# Altium schematic sheet Motor Connection.SchDoc: Motor Connection
size A4; DocumentNumber: 9; SheetNumber: 9; SheetTotal: 50
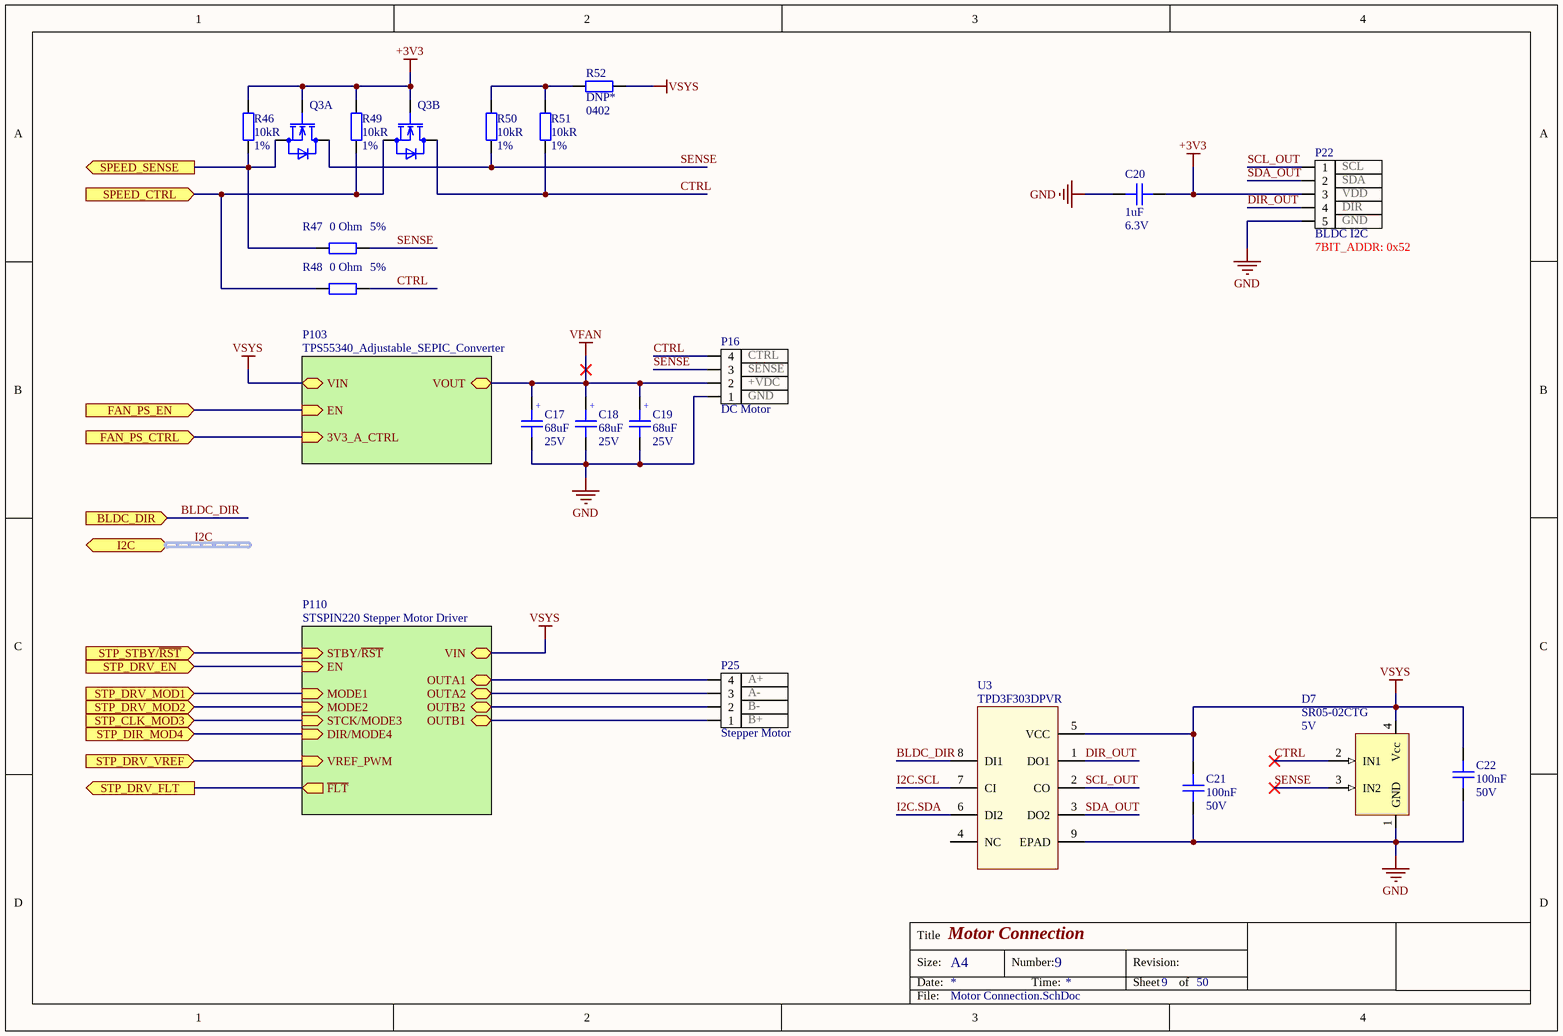
[diagram p0: Motor Connection.SchDoc]

## Parts
C17  Capacitance: 68uF  Rated Voltage: 25V  [WCAP-ASLI_6.3x5.5]  (hidden comment: CAP ALUM 68 UF 20% 25 V SMD)
C18  Capacitance: 68uF  Rated Voltage: 25V  [WCAP-ASLI_6.3x5.5]  (hidden comment: CAP ALUM 68 UF 20% 25 V SMD)
C19  Capacitance: 68uF  Rated Voltage: 25V  [WCAP-ASLI_6.3x5.5]  (hidden comment: CAP ALUM 68 UF 20% 25 V SMD)
C20  Capacitance: 1uF  Voltage Rating: 6.3V  [C0402]  (hidden comment: CAP CER 1UF 6.3V X5R 0402)
C21  Capacitance: 100nF  Voltage: 50V  [C0402]  (hidden comment: CAP CER 0.1UF 50V X7R 0402)
C22  Capacitance: 100nF  Voltage: 50V  [C0402]  (hidden comment: CAP CER 0.1UF 50V X7R 0402)
D7  SR05-02CTG  Reverse Standoff Voltage: 5V  [SOT-143]
P16  DC Motor  pin_1: GND  pin_2: +VDC  pin_3: SENSE  pin_4: CTRL  [CONN_S4B-ZR(LF)(SN)]
P22  BLDC I2C  pin_1: SCL  pin_2: SDA  pin_3: VDD  pin_4: DIR  pin_5: GND  7BIT_ADDR: 0x52  [CONN_S5B-ZR(LF)(SN)]
P25  Stepper Motor  pin_1: B+  pin_2: B-  pin_3: A-  pin_4: A+  [CONN_S4B-ZR(LF)(SN)]
Q3  DMN32D2LV-7  [SON_400UV-7_DIO]  (value not drawn)  (parts A,B of 2)
R46  Resistance: 10kR  Tolerance: 1%  [R0402]  (hidden comment: RES SMD 10K OHM 1% 1/16W 0402)
R47  Tolerance: 5%  Resistance: 0 Ohm  [R0402]  (hidden comment: RES SMD 0 OHM JUMPER 1/16W 0402)
R48  Tolerance: 5%  Resistance: 0 Ohm  [R0402]  (hidden comment: RES SMD 0 OHM JUMPER 1/16W 0402)
R49  Resistance: 10kR  Tolerance: 1%  [R0402]  (hidden comment: RES SMD 10K OHM 1% 1/16W 0402)
R50  Resistance: 10kR  Tolerance: 1%  [R0402]  (hidden comment: RES SMD 10K OHM 1% 1/16W 0402)
R51  Resistance: 10kR  Tolerance: 1%  [R0402]  (hidden comment: RES SMD 10K OHM 1% 1/16W 0402)
R52  DNP*  Case/Package: 0402  [R0402]  (no BOM)
U3  TPD3F303DPVR  [DPV8_1P7X0P4]

## Sub-sheets
P103 = TPS55340_Adjustable_SEPIC_Converter: EN (in), VIN, VOUT, 3V3_A_CTRL (in)
P110 = STSPIN220 Stepper Motor Driver: MODE1 (in), OUTB1, VREF_PWM (in), EN (in), MODE2 (in), OUTB2, OUTA2, DIR/MODE4 (in), STCK/MODE3 (in), ~{FLT} (out), STBY/~{RST} (in), OUTA1, VIN

## Ports
BLDC_DIR (in), FAN_PS_CTRL (in), FAN_PS_EN (in), I2C (harness I2C), SPEED_CTRL (in), SPEED_SENSE (out), STP_CLK_MOD3 (in), STP_DIR_MOD4 (in), STP_DRV_EN (in), STP_DRV_FLT (out), STP_DRV_MOD1 (in), STP_DRV_MOD2 (in), STP_DRV_VREF (in), STP_STBY/~{RST} (in)

## Nets
+3V3: C20.2 P22.3 Q3.2(G) Q3.5(G) R46.1 R49.1
GND: C17.2 C18.2 C19.2 C20.1 C21.2 C22.1 D7.1(GND) P16.1 P22.5 U3.9(EPAD)
VFAN: C17.1 C18.1 C19.1 P16.2 ; sheet P103/VOUT
VSYS: C21.1 C22.2 D7.4(Vcc) R52.1 U3.5(VCC) ; sheet P110/VIN, sheet P103/VIN
BLDC_DIR: U3.8(DI1) ; port BLDC_DIR
CTRL: D7.2(IN1) P16.4 Q3.3(D) R48.2 R51.2
DIR_OUT: P22.4 U3.1(DO1)
FAN_PS_CTRL: port FAN_PS_CTRL, sheet P103/3V3_A_CTRL
FAN_PS_EN: port FAN_PS_EN, sheet P103/EN
I2C.SCL: U3.7(CI)
I2C.SDA: U3.6(DI2)
SCL_OUT: P22.1 U3.2(CO)
SDA_OUT: P22.2 U3.3(DO2)
SENSE: D7.3(IN2) P16.3 Q3.6(D) R47.2 R50.2
SPEED_CTRL: Q3.4(S) R48.1 R49.2 ; port SPEED_CTRL
SPEED_SENSE: Q3.1(S) R46.2 R47.1 ; port SPEED_SENSE
STP_CLK_MOD3: port STP_CLK_MOD3, sheet P110/STCK/MODE3
STP_DIR_MOD4: port STP_DIR_MOD4, sheet P110/DIR/MODE4
STP_DRV_EN: port STP_DRV_EN, sheet P110/EN
STP_DRV_FLT: port STP_DRV_FLT, sheet P110/~{FLT}
STP_DRV_MOD1: port STP_DRV_MOD1, sheet P110/MODE1
STP_DRV_MOD2: port STP_DRV_MOD2, sheet P110/MODE2
STP_DRV_VREF: port STP_DRV_VREF, sheet P110/VREF_PWM
STP_STBY/~{RST}: port STP_STBY/~{RST}, sheet P110/STBY/~{RST}
NetP25_1: P25.1 ; sheet P110/OUTB1
NetP25_2: P25.2 ; sheet P110/OUTB2
NetP25_3: P25.3 ; sheet P110/OUTA2
NetP25_4: P25.4 ; sheet P110/OUTA1
NetR50_1: R50.1 R51.1 R52.2

Not connected (* = marked no-connect by the designer): U3 4(NC)

## Buses and harness runs
harness I2C = port I2C

## Notes on the sheet
- Title
- Size:
- Date:
- A4
- Number:
- Time:
- Revision:
- Sheet
- of
- File:
- (in symbol CAP ALUM 68 UF 20% 25 V SMD) +

## Library data of the parts
C17-C19 = CAP ALUM 68 UF 20% 25 V SMD: 68µF 25V Aluminum Electrolytic Capacitors Radial, Can - SMD  2000 Hrs @ 105°C; Manufacturer: Wurth Elektronik; Manufacturer Part Number: 865080443009; Dissipation Factor: 14%; Endurance: 2000h; Leakage Current: 17uA; Ripple Current: 240mA; Capacitance Tolerance: +/-20%; Technical Reference: ASED055680M025DVCTBB000; Supplier 1: Digi-Key; Packaging: Tape and Reel; ComponentLink1URL: http://www.we-online.de; ComponentLink1Description: Manufacturer; Supplier Part Number 1: 732-8437-1-ND; Diameter: 6.3mm; Height: 5.5mm; ComponentLink2URL: https://www.we-online.com/catalog/datasheet/865080443009.pdf; ComponentLink2Description: Datasheet; Mounting Technology: SMT; Operating Temperature: -55 to +105degC; Published Date: May 2020; Mount: Surface Mount
C20 = CAP CER 1UF 6.3V X5R 0402: 1µF ±10% 6.3V Ceramic Capacitor X5R 0402 (1005 Metric); Manufacturer: Yageo; Manufacturer Part Number: CC0402KRX5R5BB105; Supplier 1: Digi-Key; Stock 1: 34926286; Pricing 1: 1=0.1, 10=0.05, 50=0.0272, 100=0.0222, 500=0.0158, 1000=0.0124, 2500=0.0113, 5000=0.0104 (USD); Mount: Surface Mount; Number of Pins: 2; Case Code (Imperial): 0402; Case Code (Metric): 1005; Min Operating Temperature: -55°C; Max Operating Temperature: 85°C; Tolerance: 10%; Packaging: Tape and Reel; Termination: SMD/SMT; Voltage Rating (DC): 6.3V; Composition: Ceramic; Length: 1mm; Height: 0.5mm; Width: 0.02inch; Thickness: 0.022inch; Depth: 0.5mm; Radiation Hardening: No; Lead Free: Lead Free; Halogen Free: Halogen Free; ComponentLink1URL: http://www.farnell.com/datasheets/70765.pdf?src-supplier=Farnell; ComponentLink1Description: http://www.farnell.com/datasheets/70765.pdf?src-supplier=Farnell; Supplier Part Number 1: 311-1438-1-ND; Dielectric: X5R; Case/Package: 0402; Dielectric Material: Ceramic; Package Quantity: 1; REACH SVHC: No SVHC; ComponentLink2URL: http://www.yageo.com/documents/recent/UPY-GPHC_X5R_4V-to-50V_25.pdf?src-supplier=Digi-Key; ComponentLink2Description: http://www.yageo.com/documents/recent/UPY-GPHC_X5R_4V-to-50V_25.pdf?src-supplier=Digi-Key; ComponentLink3URL: http://www.farnell.com/datasheets/2167237.pdf?src-supplier=Element14; ComponentLink3Description: http://www.farnell.com/datasheets/2167237.pdf?src-supplier=Element14; ComponentLink4URL: http://www.yageo.com/documents/recent/UPY-GPHC_X5R_4V-to-50V_12.pdf?src-supplier=Avnet+Europe; ComponentLink4Description: http://www.yageo.com/documents/recent/UPY-GPHC_X5R_4V-to-50V_12.pdf?src-supplier=Avnet+Europe; ComponentLink5URL: http://www.farnell.com/datasheets/1359354.pdf?src-supplier=Element14; ComponentLink5Description: http://www.farnell.com/datasheets/1359354.pdf?src-supplier=Element14; ComponentLink6URL: http://www.farnell.com/datasheets/70765.pdf?src-supplier=Element14; ComponentLink6Description: http://www.farnell.com/datasheets/70765.pdf?src-supplier=Element14; ComponentLink7URL: http://www.yageo.com/documents/recent/UPY-GPHC_X5R_4V-to-50V_12.pdf?src-supplier=Avnet; ComponentLink7Description: http://www.yageo.com/documents/recent/UPY-GPHC_X5R_4V-to-50V_12.pdf?src-supplier=Avnet
C21 C22 = CAP CER 0.1UF 50V X7R 0402: 0.1µF ±10% 50V Ceramic Capacitor X7R 0402 (1005 Metric); Manufacturer: TDK; Manufacturer Part Number: CGA2B3X7R1H104K050BB; Supplier 1: Digi-Key; Stock 1: 2925303; Pricing 1: 1=0.17, 10=0.118, 50=0.0668, 100=0.0553, 500=0.0388, 1000=0.0321, 2500=0.0299, 5000=0.0273 (USD); Mount: Surface Mount; Case/Package: 0402; Weight: 2.3E-05oz; Case Code (Metric): 1005; Case Code (Imperial): 0402; Min Operating Temperature: -55°C; Max Operating Temperature: 125°C; Voltage Rating: 50V; Tolerance: 10%; Packaging: Tape and Reel; Package Quantity: 1; Voltage Rating (DC): 50V; Dielectric: X7R; Termination: SMD/SMT; Composition: Ceramic; Length: 1mm; Height: 0.5mm; Width: 0.02inch; Thickness: 0.022inch; Depth: 0.5mm; Ratings: AEC-Q200; REACH SVHC: No SVHC; Lead Free: Lead Free; ComponentLink1URL: http://product.tdk.com/capacitor/mlcc/en/documents/mlccspec_automotive_general_midvoltage_en.pdf?src-supplier=Future+Electronics; ComponentLink1Description: http://product.tdk.com/capacitor/mlcc/en/documents/mlccspec_automotive_general_midvoltage_en.pdf?src-supplier=Future+Electronics; ComponentLink2URL: http://www.farnell.com/datasheets/1807242.pdf?src-supplier=Element14; ComponentLink2Description: http://www.farnell.com/datasheets/1807242.pdf?src-supplier=Element14; ComponentLink3URL: http://www.mouser.com/ds/2/400/lcc_automotive_general_en-843974.pdf?src-supplier=Mouser; ComponentLink3Description: http://www.mouser.com/ds/2/400/lcc_automotive_general_en-843974.pdf?src-supplier=Mouser; ComponentLink4URL: http://www.farnell.com/datasheets/1936565.pdf?src-supplier=Element14; ComponentLink4Description: http://www.farnell.com/datasheets/1936565.pdf?src-supplier=Element14; ComponentLink5URL: http://www.farnell.com/datasheets/1735392.pdf?src-supplier=Element14; ComponentLink5Description: http://www.farnell.com/datasheets/1735392.pdf?src-supplier=Element14; Supplier Part Number 1: 445-6899-1-ND
D7 = TVS DIODE 5VWM 18VC SOT143: Manufacturer: Littelfuse; Direction: Unidirectional; Capacitance: 6pF; Max Surge Current: 25A; Number of Bidirectional Channels: 2; Min Breakdown Voltage: 6V; Clamping Voltage: 18V; Peak Pulse Power: 450W; Power Line Protection: Yes; Leakage Current: 5uA; Element Configuration: Dual; Supplier 1: Digi-Key; Manufacturer Part Number: SR05-02CTG; Stock 1: 3644; Pricing 1: 1=0.73, 10=0.646, 25=0.6068, 100=0.4403, 250=0.4247, 500=0.3679, 1000=0.3131 (USD); Mount: Surface Mount; Case/Package: SOT-143; Number of Pins: 4; Min Operating Temperature: -40°C; Max Operating Temperature: 125°C; Operating Supply Voltage: 5V; Packaging: Tape and Reel; Package Quantity: 1; Number of Channels: 2; Breakdown Voltage: 6V; Termination: SMD/SMT; Max Power Dissipation: 450W; Working Voltage: 5V; Peak Pulse Current: 25A; Length: 3.04mm; Height: 1.22mm; Depth: 1.4mm; Radiation Hardening: No; REACH SVHC: No SVHC; ComponentLink1URL: http://www.littelfuse.com/~/media/electronics/datasheets/tvs_diode_arrays/littelfuse_tvs_diode_array_sr05_datasheet.pdf.pdf?src-supplier=Digi-Key; ComponentLink1Description: http://www.littelfuse.com/~/media/electronics/datasheets/tvs_diode_arrays/littelfuse_tvs_diode_array_sr05_datasheet.pdf.pdf?src-supplier=Digi-Key; ComponentLink2URL: http://www.mouser.com/ds/2/240/Littelfuse_TVS_Diode_Array_SR05-224712.pdf?src-supplier=Mouser; ComponentLink2Description: http://www.mouser.com/ds/2/240/Littelfuse_TVS_Diode_Array_SR05-224712.pdf?src-supplier=Mouser; Supplier Part Number 1: F6188CT-ND
P16 P25 = CONN HEADER TH R/A 4POS 1.5MM: Connector Header Through Hole, Right Angle 4 position 0.059" (1.50mm); Manufacturer: JST; Manufacturer Part Number: S4B-ZR(LF)(SN); Body Plating: Tin; Number of Positions: 4; Connector Type: Header,Male Pin; Voltage Rating: 50V; Contact Resistance: 30mR; Max Current Rating: 1A; Insulation Resistance: 500MR; Gender: Male; Pitch: 1.5mm; Panel Thickness: 3.5mm; Supplier 1: Arrow; Stock 1: 0; Mount: Through Hole; Number of Pins: 4; Color: White; Contact Plating: Tin,Copper; Contact Material: Brass,Tin,Copper; Material: Nylon; Housing Color: Beige; Housing Material: Polyamide; Contact Shape: Circular; Insulation Material: Nylon; Insulation Color: Natural; Min Operating Temperature: -25°C; Max Operating Temperature: 85°C; Packaging: Bulk; Number of Rows: 1; Termination: Solder; Voltage Rating (DC): 50V; Current Rating: 1A; Voltage Rating (AC): 50V; Fastening Type: Detent; Max Voltage Rating (AC): 50V; Max Voltage Rating (DC): 50V; Number of Contacts: 4; Orientation: Right Angle; Length: 7.5mm; Height: 7.2mm; Width: 3.5mm; Depth: 6mm; Lead Pitch: 1.5mm; Contact Mating Length: 0.094inch; REACH SVHC: No SVHC; Lead Free: Lead Free; Flammability Rating: UL94 V-0; ComponentLink1URL: https://www.verical.com/server-webapp/html/getDatasheet?partID=763273&src-supplier=Verical; ComponentLink1Description: https://www.verical.com/server-webapp/html/getDatasheet?partID=763273&src-supplier=Verical; ComponentLink2URL: https://www.verical.com/server-webapp/html/getDatasheet?partID=640380&src-supplier=Verical; ComponentLink2Description: https://www.verical.com/server-webapp/html/getDatasheet?partID=640380&src-supplier=Verical; ComponentLink3URL: http://www1.futureelectronics.com/doc/JST/S4B-ZR(LF)(SN).pdf?src-supplier=Future+Electronics; ComponentLink3Description: http://www1.futureelectronics.com/doc/JST/S4B-ZR(LF)(SN).pdf?src-supplier=Future+Electronics; ComponentLink4URL: http://www.jst-mfg.com/product/pdf/eng/eZH.pdf?src-supplier=Digi-Key; ComponentLink4Description: http://www.jst-mfg.com/product/pdf/eng/eZH.pdf?src-supplier=Digi-Key; ComponentLink5URL: http://www.farnell.com/datasheets/80556.pdf?src-supplier=Element14; ComponentLink5Description: http://www.farnell.com/datasheets/80556.pdf?src-supplier=Element14; ComponentLink6URL: https://www.verical.com/server-webapp/html/getDatasheet?partID=703398&src-supplier=Verical; ComponentLink6Description: https://www.verical.com/server-webapp/html/getDatasheet?partID=703398&src-supplier=Verical; Supplier Part Number 1: S4B-ZR(LF)(SN)
P22 = CONN HEADER TH R/A 5POS 1.5MM: Connector Header Through Hole, Right Angle 5 position 0.059" (1.50mm); Manufacturer: JST; Manufacturer Part Number: S5B-ZR(LF)(SN); Number of Positions: 5; Gender: Male; Pitch: 1.5mm; Connector Type: Male Pin; Current Rating: 1A; Voltage Rating: 50V; Contact Resistance: 30mR; Supplier 1: Digi-Key; Stock 1: 41138; Pricing 1: 1=0.29, 10=0.272, 100=0.1889, 500=0.1598, 1000=0.1308, 5000=0.1162, 10000=0.1053 (USD); Mount: Through Hole; Housing Material: Polyamide; Contact Plating: Tin,Copper; Color: Natural; Min Operating Temperature: -25°C; Max Operating Temperature: 85°C; Number of Rows: 1; Packaging: Bulk; Termination: Press-Fit; Orientation: Right Angle; Number of Contacts: 5; ComponentLink1URL: http://www.jst-mfg.com/product/pdf/eng/eZH.pdf?src-supplier=Digi-Key; ComponentLink1Description: http://www.jst-mfg.com/product/pdf/eng/eZH.pdf?src-supplier=Digi-Key; Supplier Part Number 1: 455-1672-ND; Housing Color: Beige; Fastening Type: Detent; Length: 9mm; Depth: 6mm; Contact Mating Length: 0.094inch; Number of Pins: 5; Contact Material: Brass,Tin; Max Current Rating: 1A; Max Voltage Rating (AC): 50V; Height: 7.2mm; Width: 3.5mm; Lead Free: Lead Free; ComponentLink2URL: https://www.verical.com/server-webapp/html/getDatasheet?partID=640593&src-supplier=Verical; ComponentLink2Description: https://www.verical.com/server-webapp/html/getDatasheet?partID=640593&src-supplier=Verical; ComponentLink3URL: http://www1.futureelectronics.com/doc/JST/S5B-ZR(LF)(SN).pdf?src-supplier=Future+Electronics; ComponentLink3Description: http://www1.futureelectronics.com/doc/JST/S5B-ZR(LF)(SN).pdf?src-supplier=Future+Electronics; ComponentLink4URL: http://www.produktinfo.conrad.com/datenblaetter/725000-749999/741204-da-01-en-STIFTLEISTE_GEWINKELT_5_POL_RM1_5.pdf?src-supplier=Conrad; ComponentLink4Description: http://www.produktinfo.conrad.com/datenblaetter/725000-749999/741204-da-01-en-STIFTLEISTE_GEWINKELT_5_POL_RM1_5.pdf?src-supplier=Conrad
Q3 = ARRAY MOSFET 2N-CH 30V 0.4A SOT-563: Mosfet Array 2 N-Channel (Dual) 30V 400mA 400mW Surface Mount SOT-563; Manufacturer: Diodes; Gate to Source Voltage (Vgs): 10V; Rds On Max: 1.2R; Input Capacitance: 39pF; Number of Channels: 2; Supplier 1: Digi-Key; Manufacturer Part Number: DMN32D2LV-7; Stock 1: 141366; Pricing 1: 1=0.39, 10=0.338, 25=0.3152, 100=0.234, 500=0.1827, 1000=0.1485 (USD); Mount: Surface Mount; Min Operating Temperature: -55°C; Max Operating Temperature: 150°C; Continuous Drain Current (ID): 400mA; Package Quantity: 3000; Packaging: Tape and Reel; Drain to Source Voltage (Vdss): 30V; Max Power Dissipation: 400mW; Drain to Source Breakdown Voltage: 30V; Drain to Source Resistance: 1.2R; Element Configuration: Dual; FET Type: 2 N-Channel; Length: 1.6mm; Height: 0.6mm; Width: 1.2mm; Radiation Hardening: No; REACH SVHC: No SVHC; ComponentLink1URL: https://www.diodes.com/assets/Datasheets/ds31121.pdf?src-supplier=Digi-Key; ComponentLink1Description: https://www.diodes.com/assets/Datasheets/ds31121.pdf?src-supplier=Digi-Key; ComponentLink2URL: http://www.mouser.com/ds/2/115/ds31121-89496.pdf?src-supplier=Mouser; ComponentLink2Description: http://www.mouser.com/ds/2/115/ds31121-89496.pdf?src-supplier=Mouser; ComponentLink3URL: http://www.diodes.com///datasheets/ds31121.pdf?src-supplier=Avnet; ComponentLink3Description: http://www.diodes.com///datasheets/ds31121.pdf?src-supplier=Avnet; Supplier Part Number 1: DMN32D2LV-7DICT-ND; Case/Package: SOT-563; Weight: 0.000106oz; Polarity: N-CHANNEL; Series: -
R46 R49-R51 = RES SMD 10K OHM 1% 1/16W 0402: 10 kOhms ±1% 0.063W, 1/16W Chip Resistor 0402 (1005 Metric) Moisture Resistant Thick Film; Manufacturer Part Number: RC0402FR-0710KP; Manufacturer: Yageo; Temperature Coefficient: 150ppm/°C; Max Power Dissipation: 63mW; Supplier 1: Digi-Key; Stock 1: 839368; Pricing 1: 1=0.1, 10=0.035, 100=0.014, 1000=0.0063, 2500=0.0055, 5000=0.0045 (USD); Case Code (Imperial): 0402; Case Code (Metric): 1005; Min Operating Temperature: -55°C; Max Operating Temperature: 155°C; Composition: Thick Film; Packaging: Tape and Reel; Number of Terminations: 2; Length: 0.039inch; Height: 0.016inch; Width: 0.02inch; ComponentLink1URL: http://www.yageo.com/NewPortal/yageodocoutput?fileName=/pdf/R-Chip/PYu-RC_51_RoHS_P_0.pdf&src-supplier=Digi-Key; ComponentLink1Description: http://www.yageo.com/NewPortal/yageodocoutput?fileName=/pdf/R-Chip/PYu-RC_51_RoHS_P_0.pdf&src-supplier=Digi-Key; Supplier Part Number 1: YAG1249CT-ND; Case/Package: 0402; Features: Moisture Resistant; Mount: Surface Mount
R47 R48 = RES SMD 0 OHM JUMPER 1/16W 0402: 0 Ohms Jumper 0.063W, 1/16W Chip Resistor 0402 (1005 Metric) Moisture Resistant Thick Film; Manufacturer: Yageo; Manufacturer Part Number: RC0402JR-070RL; Power Rating: 62.5mW; Voltage Rating: 50V; Max Power Dissipation: 63mW; Temperature Coefficient: 200ppm/°C; Supplier 1: Digi-Key; Stock 1: 46057148; Pricing 1: 1=0.1, 10=0.013, 25=0.0092, 50=0.0072, 100=0.0053, 250=0.004, 500=0.0032, 1000=0.0024, 5000=0.0017 (USD); Contact Plating: Tin,Matte; Case Code (Metric): 1005; Case Code (Imperial): 0402; Min Operating Temperature: -55°C; Max Operating Temperature: 155°C; Packaging: Tape and Reel; Composition: Thick Film; Package Quantity: 1; Number of Terminations: 2; Termination: SMD/SMT; Military Standard: Not; Features: Moisture Resistant; Length: 1mm; Height: 0.016inch; Width: 0.02inch; Depth: 0.5mm; Radiation Hardening: No; REACH SVHC: Unknown; Lead Free: Lead Free; ComponentLink1URL: http://www.yageo.com/documents/recent/PYu-RC_Group_51_RoHS_L_10.pdf?src-supplier=Digi-Key; ComponentLink1Description: http://www.yageo.com/documents/recent/PYu-RC_Group_51_RoHS_L_10.pdf?src-supplier=Digi-Key; ComponentLink2URL: http://www.yageo.com/documents/recent/PYu-RC0402_51_RoHS_L_6.pdf?src-supplier=Avnet+Europe; ComponentLink2Description: http://www.yageo.com/documents/recent/PYu-RC0402_51_RoHS_L_6.pdf?src-supplier=Avnet+Europe; ComponentLink3URL: http://www.farnell.com/datasheets/1018594.pdf?src-supplier=Element14; ComponentLink3Description: http://www.farnell.com/datasheets/1018594.pdf?src-supplier=Element14; ComponentLink4URL: https://www.verical.com/server-webapp/html/getDatasheet?partID=326379&src-supplier=Verical; ComponentLink4Description: https://www.verical.com/server-webapp/html/getDatasheet?partID=326379&src-supplier=Verical; ComponentLink5URL: http://www.farnell.com/datasheets/2167052.pdf?src-supplier=Element14; ComponentLink5Description: http://www.farnell.com/datasheets/2167052.pdf?src-supplier=Element14; Supplier Part Number 1: 311-0.0JRCT-ND; Case/Package: 0402; Mount: Surface Mount
R52 = RES SMD NO BOM 0402: Placeholder for a 0402 resistor
U3 = FILTER RC(PI) ESD SMD  8-UFDFN EP: RC (Pi) EMI Filter 2nd Order Low Pass 3 Channel R = 47Ohms, 100Ohms, C = 20pF  8-UFDFN Exposed Pad; Manufacturer: Texas Instruments; Number of Channels: 3; Frequency: 308MHz; ESD Protection: Yes; Operating Supply Voltage: 5.5V; Clamping Voltage: 10V; Supplier 1: Digi-Key; Manufacturer Part Number: TPD3F303DPVR; Stock 1: 4896; Pricing 1: 1=0.85, 10=0.812, 25=0.7856, 50=0.6414, 100=0.576, 250=0.5236, 500=0.4974, 1000=0.4451 (USD); Case/Package: SMD/SMT; Min Operating Temperature: -40°C; Max Operating Temperature: 85°C; Packaging: Tape and Reel; ComponentLink1URL: http://www.ti.com/lit/ds/symlink/tpd3f303.pdf?src-supplier=Digi-Key; ComponentLink1Description: http://www.ti.com/lit/ds/symlink/tpd3f303.pdf?src-supplier=Digi-Key; ComponentLink2URL: http://focus.ti.com/lit/ds/symlink/tpd3f303.pdf?src-supplier=Avnet+Europe; ComponentLink2Description: http://focus.ti.com/lit/ds/symlink/tpd3f303.pdf?src-supplier=Avnet+Europe; ComponentLink3URL: https://www.verical.com/server-webapp/html/getDatasheet?partID=302817&src-supplier=Verical; ComponentLink3Description: https://www.verical.com/server-webapp/html/getDatasheet?partID=302817&src-supplier=Verical; ComponentLink4URL: http://www.farnell.com/datasheets/1558442.pdf?src-supplier=Element14; ComponentLink4Description: http://www.farnell.com/datasheets/1558442.pdf?src-supplier=Element14; Supplier Part Number 1: 296-28299-1-ND; Number of Pins: 8; Contact Plating: Gold; Package Quantity: 1; Capacitance: 20pF; Termination: Flat; Length: 2.2mm; Height: 0.026inch; Width: 0.063inch; Depth: 1.7mm; Radiation Hardening: No; Lead Free: Lead Free; REACH SVHC: No SVHC; Mount: Surface Mount